# Altium schematic sheet PowerSupply.SchDoc (part 3 of 3)
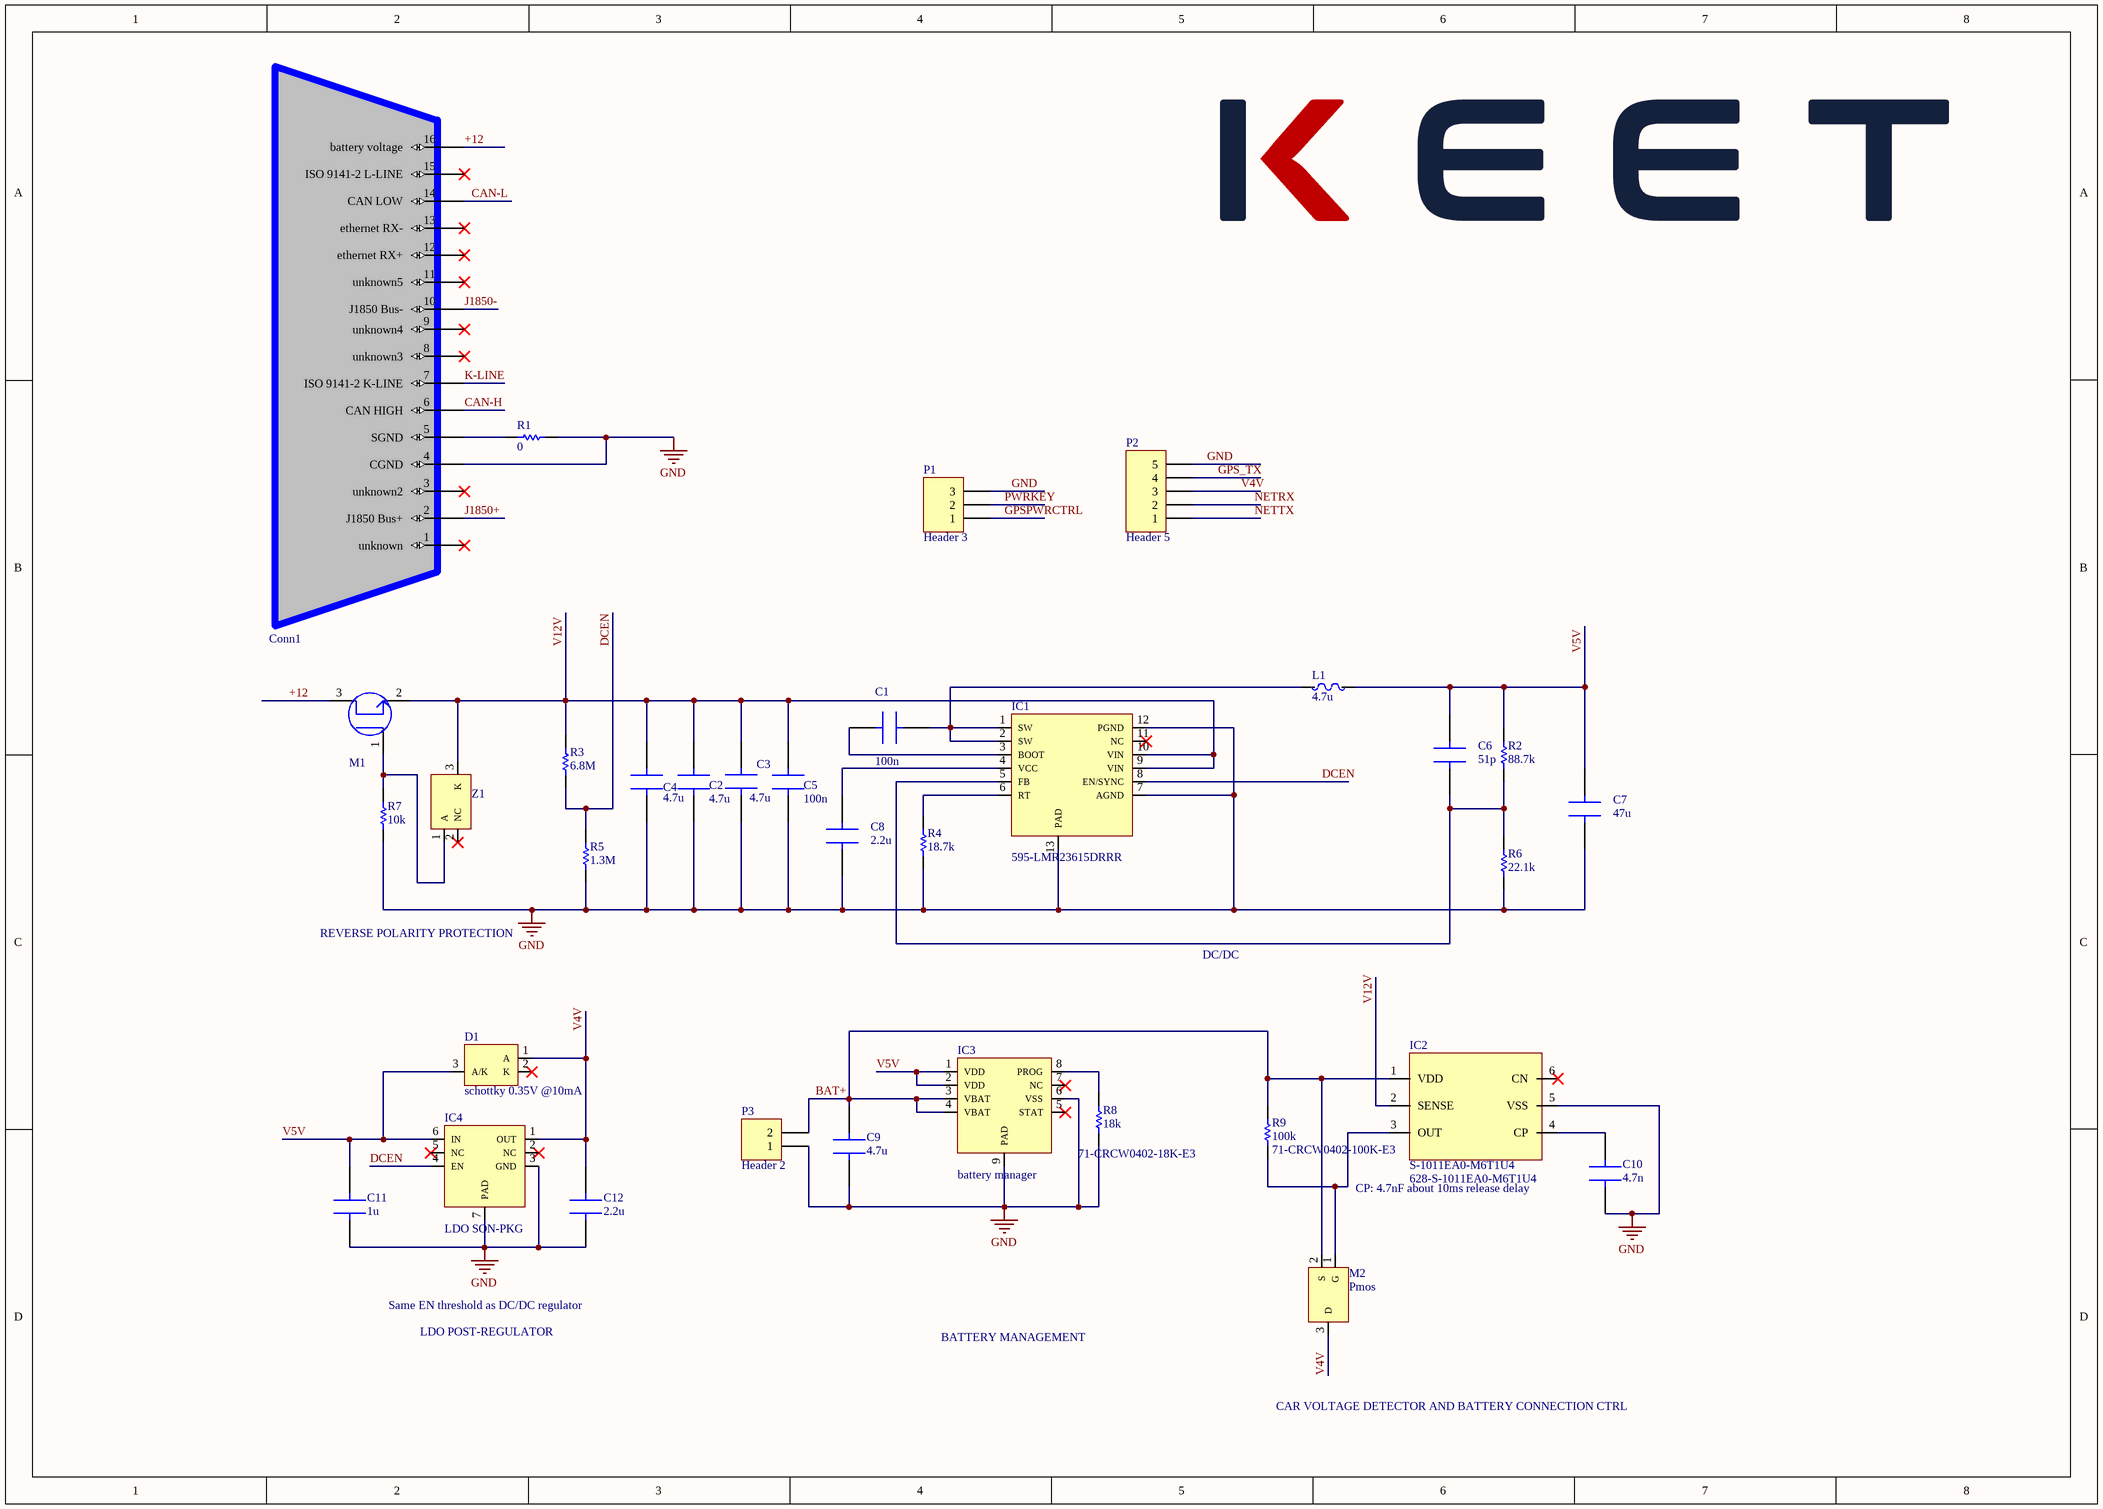
[diagram p2: PowerSupply.SchDoc]

## Library data of the parts (continued)
R9 = CRCW0402100KFKED: Res Thick Film 0402 100K Ohm 1% 1/16W 100ppm/C Molded SMD Paper T/R; Manufacturer: Vishay; Power Rating: 63mW; Resistance: 100kR; Temperature Coefficient: 100ppm/°C; Voltage Rating: 50V; Supplier 1: Mouser; Manufacturer Part Number: CRCW0402100KFKED; RoHS: Yes; Category: Chip SMD Resistors; Stock 1: 350931; Pricing 1: 1=0,10000, 10=0,03300, 50=0,03300, 100=0,01400, 1000=0,00600, 10000=0,00500 (USD); Mount: Surface Mount; Case/Package: 0402; Number of Pins: 2; Contact Plating: Tin; Weight: 2.3E-05oz; Case Code (Metric): 1005; Case Code (Imperial): 0402; Size Code: 0402; Min Operating Temperature: -55°C; Max Operating Temperature: 155°C; Tolerance: 1%; Resistor Type: Thick Film; Termination: SMD/SMT; Packaging: Tape and Reel; Package Quantity: 10000; Number of Terminations: 2; Max Power Dissipation: 63mW; Voltage Rating (DC): 50V; Features: Automotive AEC-Q200; Series: CRCW; Technology: THICK FILM; Construction: Rectangular; Resistance Tolerance: 1%; Length: 1mm; Width: 0.02inch; Height: 0.35mm; Depth: 0.5mm; Radiation Hardening: No; Lead Free: Lead Free; RoHS Compliant: Yes; REACH SVHC: Unknown; Military Standard: Not; ComponentLink1URL: https://datasheet.ciiva.com/11810/0900766b80d98824-11810752.pdf?src-supplier=RSComponents; ComponentLink1Description: https://datasheet.ciiva.com/11810/0900766b80d98824-11810752.pdf?src-supplier=RSComponents; ComponentLink2URL: https://datasheet.ciiva.com/26316/fld-crcw-e3-data-en-26316630.pdf?src-supplier=Distrelec; ComponentLink2Description: https://datasheet.ciiva.com/26316/fld-crcw-e3-data-en-26316630.pdf?src-supplier=Distrelec; ComponentLink3URL: https://datasheet.ciiva.com/2463/dcrcwe3-2463064.pdf?src-supplier=Digi-Key; ComponentLink3Description: https://datasheet.ciiva.com/2463/dcrcwe3-2463064.pdf?src-supplier=Digi-Key; ComponentLink4URL: https://datasheet.ciiva.com/2463/dcrcwe3-2463065.pdf?src-supplier=Digi-Key; ComponentLink4Description: https://datasheet.ciiva.com/2463/dcrcwe3-2463065.pdf?src-supplier=Digi-Key; ComponentLink5URL: https://datasheet.ciiva.com/16776/70201119-16776281.pdf?src-supplier=Allied+Electronics; ComponentLink5Description: https://datasheet.ciiva.com/16776/70201119-16776281.pdf?src-supplier=Allied+Electronics; ComponentLink6URL: https://datasheet.ciiva.com/16941/dcrcwe3-16941129.pdf?src-supplier=Avnet+Europe; ComponentLink6Description: https://datasheet.ciiva.com/16941/dcrcwe3-16941129.pdf?src-supplier=Avnet+Europe; ComponentLink7URL: https://datasheet.ciiva.com/2463/dcrcwe3-2463066.pdf?src-supplier=Digi-Key; ComponentLink7Description: https://datasheet.ciiva.com/2463/dcrcwe3-2463066.pdf?src-supplier=Digi-Key; ComponentLink8URL: https://datasheet.ciiva.com/3255/dcrcwe3-3255947.pdf?src-supplier=Avnet; ComponentLink8Description: https://datasheet.ciiva.com/3255/dcrcwe3-3255947.pdf?src-supplier=Avnet; ComponentLink9URL: https://datasheet.ciiva.com/3255/dcrcwe3-3255948.pdf?src-supplier=Avnet; ComponentLink9Description: https://datasheet.ciiva.com/3255/dcrcwe3-3255948.pdf?src-supplier=Avnet; ComponentLink10URL: https://datasheet.ciiva.com/16208/dcrcwe3-16208508.pdf?src-supplier=Future+Electronics; ComponentLink10Description: https://datasheet.ciiva.com/16208/dcrcwe3-16208508.pdf?src-supplier=Future+Electronics; ComponentLink11URL: https://datasheet.ciiva.com/5546/dcrcwe3-109170-5546638.pdf?src-supplier=Mouser; ComponentLink11Description: https://datasheet.ciiva.com/5546/dcrcwe3-109170-5546638.pdf?src-supplier=Mouser; ComponentLink12URL: https://datasheet.ciiva.com/46441/1720486-46441598.pdf?src-supplier=Element14; ComponentLink12Description: https://datasheet.ciiva.com/46441/1720486-46441598.pdf?src-supplier=Element14
Z1 = BZX84C10LT1G: ON SEMICONDUCTOR - BZX84C10LT1G - Zener Single Diode, 10 V, 225 mW, SOT-23, 6 %, 3 Pins, 150 °C; Max Power Dissipation: 225mW; Tolerance: 6%; Forward Voltage: 900mV; Max Reverse Leakage Current: 200nA; Impedance: 20R; Power Dissipation: 300mW; Test Current: 5mA; Breakdown Voltage: 10.6V; ESD Protection: Yes; Zener Current: 10mA; Supplier 1: Mouser; Manufacturer: ON Semiconductor; Manufacturer Part Number: BZX84C10LT1G; RoHS: Yes; Category: Zener Diodes; Stock 1: 59638; Pricing 1: 1=0,13000, 10=0,09200, 50=0,09200, 100=0,03900, 1000=0,02700, 10000=0,01800 (USD); Case/Package: SOT-23-3; Number of Pins: 3; Material: Plastic; Contact Plating: Tin,Matte; Min Operating Temperature: -65°C; Max Operating Temperature: 150°C; Packaging: Tape and Reel; Package Quantity: 3000; Zener Voltage: 10V; Voltage Tolerance: 6%; Working Voltage: 10V; Max Reverse Current: 200nA; Element Configuration: Single; Voltage Rating (DC): 10V; Power Rating: 225mW; Length: 0.119inch; Width: 0.055inch; Height: 0.044inch; Radiation Hardening: No; Lead Free: Lead Free; Halogen Free: Halogen Free; REACH SVHC: No SVHC; RoHS Compliant: Yes; ComponentLink1URL: https://datasheet.ciiva.com/18435/70100187-18435125.pdf?src-supplier=Allied+Electronics; ComponentLink1Description: https://datasheet.ciiva.com/18435/70100187-18435125.pdf?src-supplier=Allied+Electronics; ComponentLink2URL: https://datasheet.ciiva.com/894/bzx84c2v4lt1-d-894713.pdf?src-supplier=Digi-Key; ComponentLink2Description: https://datasheet.ciiva.com/894/bzx84c2v4lt1-d-894713.pdf?src-supplier=Digi-Key; ComponentLink3URL: https://datasheet.ciiva.com/894/bzx84c2v4lt1-d-894714.pdf?src-supplier=Digi-Key; ComponentLink3Description: https://datasheet.ciiva.com/894/bzx84c2v4lt1-d-894714.pdf?src-supplier=Digi-Key; ComponentLink4URL: https://datasheet.ciiva.com/8345/bzx84c2v4lt1-d-8345770.pdf?src-supplier=Avnet; ComponentLink4Description: https://datasheet.ciiva.com/8345/bzx84c2v4lt1-d-8345770.pdf?src-supplier=Avnet; ComponentLink5URL: https://datasheet.ciiva.com/894/bzx84c2v4lt1-d-894715.pdf?src-supplier=Digi-Key; ComponentLink5Description: https://datasheet.ciiva.com/894/bzx84c2v4lt1-d-894715.pdf?src-supplier=Digi-Key; ComponentLink6URL: https://datasheet.ciiva.com/16419/bzx84c2v4lt1-d-16419756.pdf?src-supplier=Future+Electronics; ComponentLink6Description: https://datasheet.ciiva.com/16419/bzx84c2v4lt1-d-16419756.pdf?src-supplier=Future+Electronics; ComponentLink7URL: https://datasheet.ciiva.com/8026/bzx84c2v4lt1-d-8026718.pdf?src-supplier=Element14; ComponentLink7Description: https://datasheet.ciiva.com/8026/bzx84c2v4lt1-d-8026718.pdf?src-supplier=Element14; ComponentLink8URL: https://datasheet.ciiva.com/16473/bzx84c2v4lt1-d-16473599.pdf?src-supplier=Avnet+Asia; ComponentLink8Description: https://datasheet.ciiva.com/16473/bzx84c2v4lt1-d-16473599.pdf?src-supplier=Avnet+Asia; ComponentLink9URL: https://datasheet.ciiva.com/22626/1874542-22626847.pdf?src-supplier=Element14; ComponentLink9Description: https://datasheet.ciiva.com/22626/1874542-22626847.pdf?src-supplier=Element14; Supplier Part Number 1: 863-BZX84C10LT1G